# Altium schematic sheet USB-OTG.SchDoc
size A3; Author: ALP Electronics; CompanyName: ALP Electronics; DrawnBy: Caner Alp; Engineer: Caner Alp; Organization: ALP Electronics; Address2: Västerås; Address4: Sweden; SheetNumber: 13; SheetTotal: 13
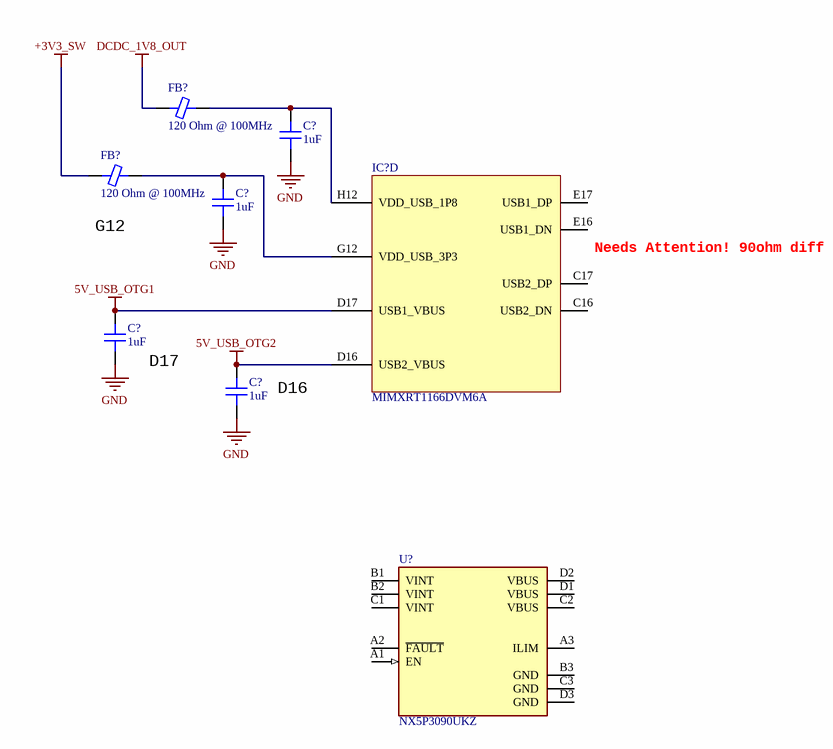
[diagram p0: USB-OTG.SchDoc]

## Parts
(Parts that share a designator on the sheet are numbered #1, #2 ... from top to bottom, then left to right.)
C?#1  1uF  [CAP 0402/1005]
C?#2  1uF  [CAP 0402/1005]
C?#3  1uF  [CAP 0402/1005]
C?#4  1uF  [CAP 0402/1005]
FB?#1  120 Ohm @ 100MHz  [FER 0402/1005]
FB?#2  120 Ohm @ 100MHz  [FER 0402/1005]
IC?  MIMXRT1166DVM6A  [BGA289C80P17X17_1400X1400X152]  (part D of 12)
U?  NX5P3090UKZ  [FP-SOT1390-5-IPC_C]

## Nets
5V_USB_OTG1: C?#3.2 IC?.D17(USB1_VBUS)
5V_USB_OTG2: C?#4.2 IC?.D16(USB2_VBUS)
+3V3_SW: FB?#2.1
DCDC_1V8_OUT: FB?#1.1
GND: C?#1.1 C?#2.1 C?#3.1 C?#4.1
NetC?#1_2: C?#1.2 FB?#1.2 IC?.H12(VDD_USB_1P8)
NetC?#2_2: C?#2.2 FB?#2.2 IC?.G12(VDD_USB_3P3)

Not connected (* = marked no-connect by the designer): IC? C16(USB2_DN) C17(USB2_DP) E16(USB1_DN) E17(USB1_DP); U? A1(EN) A2(~{FAULT}) A3(ILIM) B1(VINT) B2(VINT) B3(GND) C1(VINT) C2(VBUS) C3(GND) D1(VBUS) D2(VBUS) D3(GND)

## Notes on the sheet
- (near FB?#2) G12
- (near IC?) Needs Attention! 90ohm diff
- (near C?#3) D17
- (near C?#4) D16
- Title:
- Size:
- Project:
- A3
- Date:
- Revision:
- Drawn By:
- Sheet
- of

## Library data of the parts
C?#1-C?#4 = GRM155R60J105KE19D: CAP CER 1UF 6.3V X5R 0402; Manufacturer: Murata Electronics North America; TemperatureRange: -55C ~ 85C; Tolerance: 10%; Value: 1uF; Part Number: GRM155R60J105KE19D; PartId: 12330; Supplier 1: Digi-Key; Supplier Part Number 1: 490-1320-2-ND; ComponentLink1Description: Datasheet; ComponentLink1URL: http://www.murata.com/~/media/webrenewal/support/library/catalog/products/capacitor/mlcc/c02e.pdf; ComponentLink2Description: Digi-Key Listing; ComponentLink2URL: https://www.digikey.com/product-detail/en/murata-electronics-north-america/GRM155R60J105KE19D/490-1320-2-ND/587208; TemperatureCoefficient: X5R; Voltage: 6.3V; Price: 0,006; Device Package: 0402 (1005 Metric)
FB?#1 FB?#2 = CIM05U121NC: FERRITE CHIP 120 OHM 600MA 0402; Manufacturer: Samsung Electro-Mechanics America, Inc.; Type: Differential Mode - Single; DC Resistance: 250 mOhm Max; Part Number: CIM05U121NC; PartId: 6447; Value: 120 Ohm @ 100MHz; Supplier 1: Digi-Key; Supplier Part Number 1: 1276-6345-2-ND; ComponentLink1Description: Datasheet; ComponentLink1URL: http://www.samsungsem.com/kr/front/downloadcms.do?path=/kr/support/product-search/bead/__icsFiles/afieldfile/2014/11/13&fileName=S_CIM05J102NC.pdf; ComponentLink2Description: Digi-Key listing; ComponentLink2URL: http://digikey.com/product-detail/en/CIM05U121NC/1276-6345-2-ND/3973775; Price: 0,0147; Device Package: 0402 (1005 Metric); Current Rating: 600mA
IC? = MIMXRT1166DVM6A: Integrated Circuit; Manufacturer_Name: NXP; Datasheet Link: https://www.mouser.in/datasheet/2/302/IMXRT1160CEC-2335852.pdf; Height: 1.52mm; Manufacturer_Part_Number: MIMXRT1166DVM6A; Mouser Part Number: 771-MIMXRT1166DVM6A; Mouser Price/Stock: https://www.mouser.co.uk/ProductDetail/NXP-Semiconductors/MIMXRT1166DVM6A?qs=DRkmTr78QARbPfoaiaD1vg%3D%3D
U? = CMP-10136-000001-1: IC PWR SWITCH 1:1 12WLCSP; Manufacturer: NXP Semiconductors; Standoff Height: 0.17mm; Description: Power Switch/Driver 1:1  3.3A 12-WLCSP (1.65x1.35); Output Current: 3A; Max Junction Temp: +150°C; Number Of Outputs: 1; Min Supply Voltage: 2.5V; Max Power Dissipation: 910mW; Max Supply Voltage: 5.5V; Output Voltage: 5V; Nominal Supply Current: 196-210uA; Ambient Temperature Range High: +85°C; RoHS: TRUE; Temperature Range High: +150°C; Digikey Description: IC PWR SWITCH 1:1 12WLCSP; Height: 0.565mm; ComponentLink2URL: https://www.nxp.com/docs/en/data-sheet/NX5P3090.pdf; Package: SOT1390-5; Octopart: https://octopart.com/nx5p3090ukz-nxp+semiconductors-74624074; Automotive: No; ComponentLink2Description: Datasheet; Temperature Range Low: -40°C; Lead Free: Yes; Footprint Url: https://www.nxp.com/docs/en/package-information/SOT1390-5.pdf; Manufacturer Part Number: NX5P3090UKZ; Device Class L2: Power Management ICs; Ambient Temperature Range Low: -40°C; Device Class L1: Integrated Circuits (ICs); Category: IC; Ipc Land Pattern Name: BGA12N40P3X4_165X135X52; Temperature: -40°C to +150°C; Device Class L3: unset